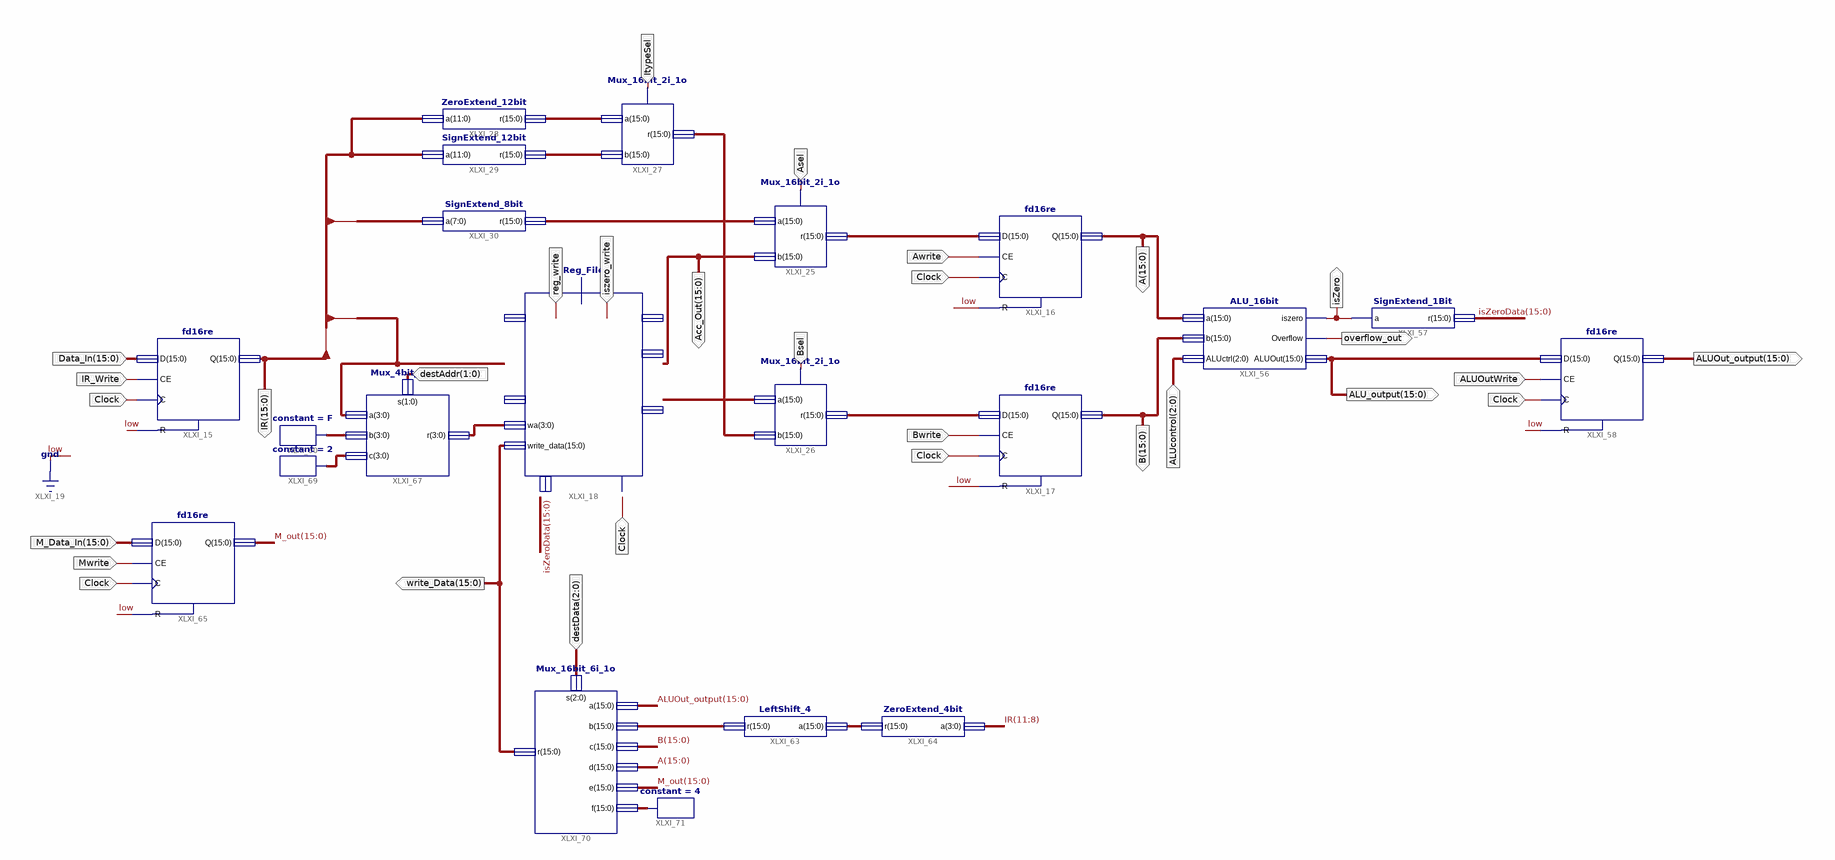
[diagram p0: schematic sheet 1]
// Xilinx ISE schematic Processor_Integration_4.sch (spartan3e) as structural Verilog: 21 symbols, 25 ports
module Processor_Integration_4 (
  input  reg_write,
  input  iszero_write,
  input  [15:0] Data_In,
  input  IR_Write,
  input  Clock,
  input  ItypeSel,
  input  Bsel,
  input  Asel,
  input  Bwrite,
  input  Awrite,
  input  [2:0] ALUcontrol,
  input  ALUOutWrite,
  input  [2:0] destData,
  input  [15:0] M_Data_In,
  input  Mwrite,
  input  [1:0] destAddr,
  output [15:0] Acc_Out,
  output [15:0] B,
  output [15:0] A,
  output isZero,
  output overflow_out,
  output [15:0] ALU_output,
  output [15:0] IR,
  output [15:0] write_Data,
  output [15:0] ALUOut_output
);

  wire [3:0] write_address, XLXN_147, XLXN_169;
  wire [15:0] isZeroData, M_out, XLXN_56, XLXN_57, XLXN_98, XLXN_101, XLXN_130, XLXN_131, XLXN_152, XLXN_156,
       XLXN_164, XLXN_172;

  fd16re XLXI_15 (.C(Clock), .CE(IR_Write), .D(Data_In), .R(1'b0), .Q(IR));
  Reg_File XLXI_18 (
    .write_data(write_Data), .reg_write(reg_write), .iszero_write(iszero_write), .acc_data(Acc_Out),
    .ra(IR[11:8]), .read_data(XLXN_98), .wa(write_address), .iszero_data(isZeroData), .clock(Clock));  // open: in_data_write, out_data, in_data
  SignExtend_12bit XLXI_29 (.a(IR[11:0]), .r(XLXN_57));
  ZeroExtend_12bit XLXI_28 (.a(IR[11:0]), .r(XLXN_56));
  SignExtend_8bit XLXI_30 (.a(IR[7:0]), .r(XLXN_101));
  Mux_16bit_2i_1o XLXI_27 (.b(XLXN_57), .r(XLXN_164), .s(ItypeSel), .a(XLXN_56));
  Mux_16bit_2i_1o XLXI_26 (.b(XLXN_164), .r(XLXN_131), .s(Bsel), .a(XLXN_98));
  Mux_16bit_2i_1o XLXI_25 (.b(Acc_Out), .r(XLXN_130), .s(Asel), .a(XLXN_101));
  fd16re XLXI_17 (.C(Clock), .CE(Bwrite), .D(XLXN_131), .R(1'b0), .Q(B));
  fd16re XLXI_16 (.C(Clock), .CE(Awrite), .D(XLXN_130), .R(1'b0), .Q(A));
  ALU_16bit XLXI_56 (.a(A), .b(B), .ALUctrl(ALUcontrol), .iszero(isZero), .Overflow(overflow_out), .ALUOut(ALU_output));
  SignExtend_1Bit XLXI_57 (.a(isZero), .r(isZeroData));
  fd16re XLXI_58 (.C(Clock), .CE(ALUOutWrite), .D(ALU_output), .R(1'b0), .Q(ALUOut_output));
  LeftShift_4 XLXI_63 (.a(XLXN_156), .r(XLXN_152));
  ZeroExtend_4bit XLXI_64 (.a(IR[11:8]), .r(XLXN_156));
  fd16re XLXI_65 (.C(Clock), .CE(Mwrite), .D(M_Data_In), .R(1'b0), .Q(M_out));
  Mux_4bit_3i_1o XLXI_67 (.s(destAddr), .r(write_address), .a(IR[11:8]), .b(XLXN_147), .c(XLXN_169));
  constant #(.CValue("F")) XLXI_60 (.O(XLXN_147));
  constant #(.CValue("2")) XLXI_69 (.O(XLXN_169));
  Mux_16bit_6i_1o XLXI_70 (
    .s(destData), .r(write_Data), .a(ALUOut_output), .b(XLXN_152), .c(B), .d(A), .e(M_out), .f(XLXN_172));
  constant #(.CValue("4")) XLXI_71 (.O(XLXN_172));
endmodule
